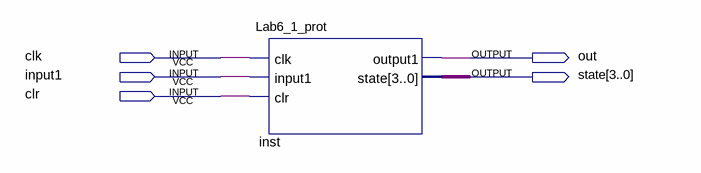
[diagram p0: schematic sheet]
// Quartus schematic Lab6_1.bdf as structural Verilog: 1 symbols, 5 pins
module Lab6_1 (
  input  clk,
  input  input1,
  input  clr,
  output out,
  output [3:0] state
);

  Lab6_1_prot inst (.clk(clk), .input1(input1), .clr(clr), .output1(out), .state(state));
endmodule
